# Altium schematic sheet Power.SchDoc
size A4; SheetNumber: 7; SheetTotal: 8
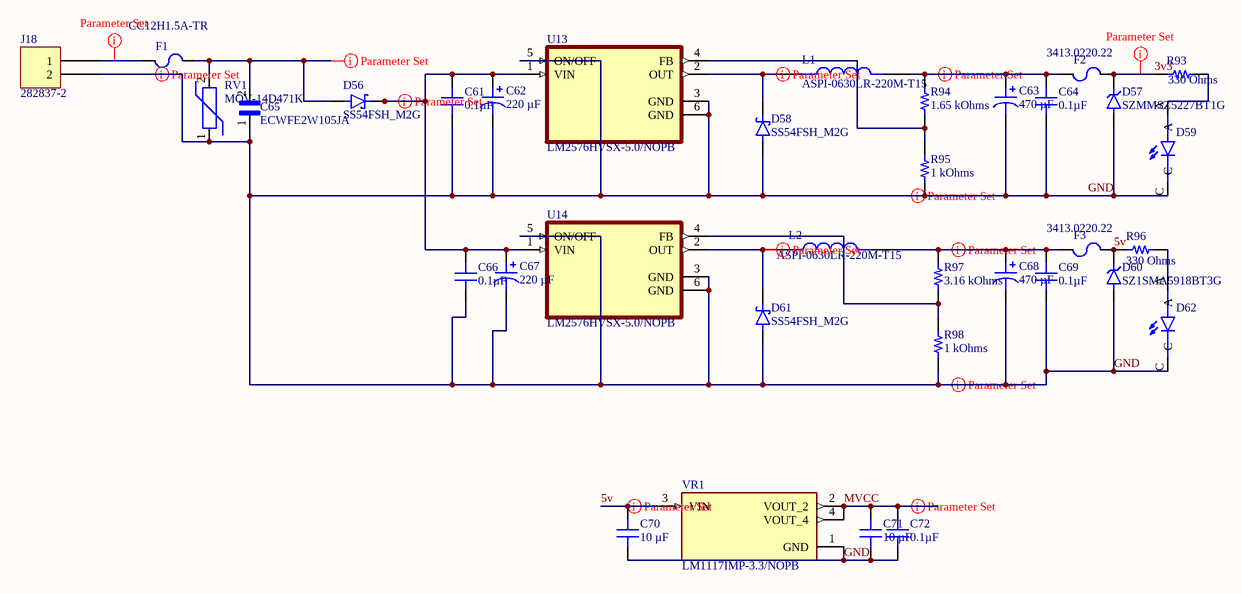
[diagram p0: Power.SchDoc]

## Parts
C61  Capacitance: 0.1µF  [CAP 0805_2012]  (hidden comment: 1µF)
C62  220 µF  [CAP ALSMD ELEC 8.3MM H11MM]
C63  470 µF  [CAP ALSMD 8.3MM H10.5MM]
C64  Capacitance: 0.1µF  [CAP 0805_2012]  (hidden comment: 1µF)
C65  ECWFE2W105JA  [CAPRR1500W80L1750T700H1250]
C66  Capacitance: 0.1µF  [CAP 0805_2012]  (hidden comment: 1µF)
C67  220 µF  [CAP ALSMD ELEC 8.3MM H11MM]
C68  470 µF  [CAP ALSMD 8.3MM H10.5MM]
C69  Capacitance: 0.1µF  [CAP 0805_2012]  (hidden comment: 1µF)
C70  10 µF  [MURATA CAP GRM31C 1206_3216]
C71  10 µF  [MURATA CAP GRM31C 1206_3216]
C72  Capacitance: 0.1µF  [CAP 0805_2012]  (hidden comment: 1µF)
D56  SS54FSH_M2G  [SODFL4725X110N]
D57  SZMMSZ5227BT1G  [DIO_SZMMSZ5227BT1G]
D58  SS54FSH_M2G  [SODFL4725X110N]
D59  597-3305-607F  [LEDC2012X70N]  (value not drawn)
D60  SZ1SMA5918BT3G  [DIOM5226X220N]
D61  SS54FSH_M2G  [SODFL4725X110N]
D62  597-3305-607F  [LEDC2012X70N]  (value not drawn)
F1  CC12H1.5A-TR  [FUSE 1206_3216 0.6MM]
F2  3413.0220.22  [FUSE 1206_3216 0.6MM]
F3  3413.0220.22  [FUSE 1206_3216 0.6MM]
J18  282837-2  [TE 282837-2]
L1  ASPI-0630LR-220M-T15  [IND_ASPI-0630LR-220M-T15]
L2  ASPI-0630LR-220M-T15  [IND_ASPI-0630LR-220M-T15]
R93  330 Ohms  [RES 0805_2012]
R94  1.65 kOhms  [RES 0805_2012]
R95  1 kOhms  [RES 0805_2012]
R96  330 Ohms  [RES 0805_2012]
R97  3.16 kOhms  [RES 0805_2012]
R98  1 kOhms  [RES 0805_2012]
RV1  MOV-14D471K  [MOV14D471K]
U13  LM2576HVSX-5.0/NOPB  [VREG_TPS79625KTTR]
U14  LM2576HVSX-5.0/NOPB  [VREG_TPS79625KTTR]
VR1  LM1117IMP-3.3/NOPB  [VREG_LM1117IMP-3.3/NOPB]

## Nets
3v3: D57.1(K) F2.2 R93.1
5v: C70.2 D60.C F3.2 R96.1 VR1.3(VIN)
GND: C61.1 C62.2 C63.2 C64.1 C65.1 C66.1 C67.2 C68.2 C69.1 C70.1 C71.1 C72.1 D57.2(A) D58.A D59.C D60.A D61.A D62.C J18.2 R95.2 R98.2 RV1.1 U13.3(GND) U13.5(ON/OFF) U13.6(GND) U14.3(GND) U14.5(ON/OFF) U14.6(GND) VR1.1(GND)
MVCC: C71.2 C72.2 VR1.2(VOUT_2) VR1.4(VOUT_4)
NetC61_2: C61.2 C62.1 C66.2 C67.1 D56.C(K) U13.1(VIN) U14.1(VIN)
NetC63_1: C63.1 C64.2 F2.1 L1.2 R94.1
NetC65_2: C65.2 D56.A F1.2 RV1.2
NetC68_1: C68.1 C69.2 F3.1 L2.2 R97.2
NetD58_C: D58.C(K) L1.1 U13.2(OUT)
NetD59_A: D59.A R93.2
NetD61_C: D61.C(K) L2.1 U14.2(OUT)
NetD62_A: D62.A R96.2
NetF1_1: F1.1 J18.1
NetR94_2: R94.2 R95.1 U13.4(FB)
NetR97_1: R97.1 R98.1 U14.4(FB)

## Layout directives
net class High_current: GND, NetC61_2, NetC63_1, NetC65_2, NetC68_1, NetD58_C, NetD61_C, NetF1_1
net class power: 3v3, 5v, GND, MVCC

## Library data of the parts
C61 C64 C66 C69 C72 = 0805ZC105KAT4A: CAP CER 1UF 10V X7R 0805; manufacturer: AVX Corporation; Tolerance: ±10%; Part Number: 0805ZC105KAT4A; Applications: General Purpose; componentlink1description: Datasheet; componentlink1url: http://datasheets.avx.com/X7RDielectric.pdf; componentlink2description: DigiKey Link; componentlink2url: http://digikey.com/product-detail/en/avx-corporation/0805ZC105KAT4A/478-7604-1-ND/7536237; Device Package: 0805 (2012 Metric); lastupdated: 02-09-2020 1.04.40 AM; Lifecycle Status: Active; Minimum Order: 1; Mounting Type: Surface Mount, MLCC; Operating Temperature: -55°C ~ 125°C; Package / Case: 0805 (2012 Metric); packaging: TapeAndReel; partid: 3500; Part Status: Active; price: 0.17; series: -; Size / Dimension: 0.079" L x 0.049" W (2.00mm x 1.25mm); Supplier 1: DigiKey; Supplier Part Number 1: 478-7604-1-ND; Temperature Coefficient: X7R; Thickness (Max): 0.037" (0.94mm); value: 1µF; Voltage - Rated: 10V
C62 C67 = UCH1V221MCS1GS: CAP ALUM 220UF 20% 35V SMD; manufacturer: Nichicon; ESR (Equivalent Series Resistance): 200mOhm @ 100kHz; Lifetime @ Temp.: 2000 Hrs @ 125°C; Polarization: Polar; Ripple Current @ High Frequency: 270 mA @ 100 kHz; Ripple Current @ Low Frequency: 135 mA @ 120 Hz; Surface Mount Land Size: 0.327" L x 0.327" W (8.30mm x 8.30mm); Part Number: UCH1V221MCS1GS; Applications: Automotive; Capacitance: 220 µF; componentlink1description: Datasheet; componentlink1url: https://www.nichicon.co.jp/english/series_items/catalog_pdf/e-uch.pdf; componentlink2description: DigiKey Link; componentlink2url: https://www.digikey.com/en/products/detail/nichicon/UCH1V221MCS1GS/13402772; Height - Seated (Max): 0.433" (11.00mm); lastupdated: 03-06-2024 8.26.59 PM; Lifecycle Status: Active; Minimum Order: 1; Mounting Type: Surface Mount; Operating Temperature: -40°C ~ 125°C; packaging: TapeAndReel; partid: 28619; price: 0.47; Ratings: AEC-Q200; series: UCH; Size / Dimension: 0.315" Dia (8.00mm); Supplier 1: DigiKey; Supplier Part Number 1: UCH1V221MCS1CT-ND; Tolerance: ±20%; value: 220 µF; Voltage - Rated: 35 V
C63 C68 = EMZL100ARA471MHA0G: CAP ALUM 470UF 20% 10V SMD; manufacturer: Chemi-Con; ESR (Equivalent Series Resistance): 160mOhm @ 100kHz; Lifetime @ Temp.: 5000 Hrs @ 105°C; Polarization: Polar; Ripple Current @ High Frequency: 600 mA @ 100 kHz; Ripple Current @ Low Frequency: 300 mA @ 120 Hz; Surface Mount Land Size: 0.327" L x 0.327" W (8.30mm x 8.30mm); Part Number: EMZL100ARA471MHA0G; Applications: Automotive; Capacitance: 470 µF; componentlink1description: Datasheet; componentlink1url: https://www.chemi-con.co.jp/products/relatedfiles/capacitor/catalog/MZLRA-e.PDF; componentlink2description: DigiKey Link; componentlink2url: https://www.digikey.com/en/products/detail/chemi-con/EMZL100ARA471MHA0G/17728433; Height - Seated (Max): 0.413" (10.50mm); lastupdated: 03-06-2024 8.15.40 PM; Lifecycle Status: Active; Minimum Order: 1; Mounting Type: Surface Mount; Operating Temperature: -55°C ~ 105°C; packaging: TapeAndReel; partid: 28535; price: 0.15; Ratings: AEC-Q200; series: Alchip™- MZL; Size / Dimension: 0.315" Dia (8.00mm); Supplier 1: DigiKey; Supplier Part Number 1: 565-EMZL100ARA471MHA0GCT-ND; Tolerance: ±20%; value: 470 µF; Voltage - Rated: 10 V
C70 C71 = GRM31CR71E106KA12K: CAP CER 10UF 25V X7R 1206; manufacturer: Murata Electronics; Tolerance: ±10%; Part Number: GRM31CR71E106KA12K; Capacitance: 10 µF; Applications: General Purpose; componentlink1description: Datasheet; componentlink1url: https://search.murata.co.jp/Ceramy/image/img/A01X/G101/ENG/GRM31CR71E106KA12-01.pdf; componentlink2description: DigiKey Link; componentlink2url: https://www.digikey.com/en/products/detail/murata-electronics/GRM31CR71E106KA12K/4905618; Device Package: 1206 (3216 Metric); lastupdated: 29-03-2026 9.05.15 PM; Lifecycle Status: Active; Minimum Order: 1; Mounting Type: Surface Mount, MLCC; Operating Temperature: -55°C ~ 125°C; Package / Case: 1206 (3216 Metric); packaging: TapeAndReel; partid: 19493; Part Status: Active; price: 0.07; series: GRM; Size / Dimension: 0.126" L x 0.063" W (3.20mm x 1.60mm); Supplier 1: DigiKey; Supplier Part Number 1: 490-14678-1-ND; Temperature Coefficient: X7R; Thickness (Max): 0.071" (1.80mm); value: 10 µF; Voltage - Rated: 25V
D56 D58 D61 = SS54FSH_M2G: Schottky Diodes & Rectifiers 5A, 40V, Schottky Rectifier; MF: Taiwan Semiconductor; MP: SS54FSH M2G; SnapEDA_Link: https://www.snapeda.com/parts/SS54FSH%20M2G/taiwan/view-part/?ref=snap; Package: None; Value: *; Check_prices: https://www.snapeda.com/parts/SS54FSH%20M2G/taiwan/view-part/?ref=eda
D59 D62 = 597-3305-607F: LED Uni-Color Green 4-Pin Chip 0805 T/R; Availability: Unavailable; Value: *; Price: None; MP: 597-3305-607F; Package: None
D60 = SZ1SMA5918BT3G: Zener Diode 5.1 V 1.5 W Â±5% Surface Mount SMA; MF: ON Semiconductor; SnapEDA_Link: https://www.snapeda.com/parts/SZ1SMA5918BT3G/Onsemi/view-part/?ref=snap; Package: SMA-2 ON Semiconductor; Value: *; MP: SZ1SMA5918BT3G; Check_prices: https://www.snapeda.com/parts/SZ1SMA5918BT3G/Onsemi/view-part/?ref=eda
F1 = CC12H1.5A-TR: FUSE BOARD MOUNT 1.5A 63VDC 1206; Manufacturer: Eaton - Electronics Division; Approval Agency: cURus; Breaking Capacity @ Rated Voltage: 50A; Fuse Type: Board Mount (Cartridge Style Excluded); Melting I²t: 0.4; Response Time: Slow Blow; Voltage Rating - DC: 63V; Part Number: CC12H1.5A-TR; Approvals: cURus; ComponentLink1Description: Datasheet; ComponentLink1URL: http://www.cooperindustries.com/content/dam/public/bussmann/Electronics/Resources/product-datasheets/Bus_Elx_DS_4309_CC12H_Series.pdf; ComponentLink2Description: DigiKey Link; ComponentLink2URL: http://digikey.com/product-detail/en/eaton-electronics-division/CC12H1.5A-TR/283-2979-1-ND/2138910; Current Rating (Amps): 1.5A; Device Package: 1206 (3216 Metric); LastUpdated: 02-09-2020 1.30.41 AM; Lifecycle Status: Active; Minimum Order: 1; Mounting Type: Surface Mount; Operating Temperature: -55°C ~ 125°C; Package / Case: 1206 (3216 Metric); Packaging: TapeAndReel; Part Status: Active; Price: 0.39; Series: CC12H; Size / Dimension: 0.126" L x 0.063" W x 0.024" H (3.20mm x 1.60mm x 0.60mm); Supplier 1: DigiKey; Supplier Part Number 1: 283-2979-1-ND
F2 F3 = 3413.0220.22: FUSE BOARD MNT 2.5A 32VAC 63VDC; Manufacturer: Schurter Inc.; Approval Agency: cURus, VDE; Breaking Capacity @ Rated Voltage: 63A; Fuse Type: Board Mount (Cartridge Style Excluded); Melting I²t: 0.94; Response Time: Fast Blow; Voltage Rating - AC: 32V; Voltage Rating - DC: 63V; Part Number: 3413.0220.22; Approvals: cURus, VDE; ComponentLink1Description: Datasheet; ComponentLink1URL: https://us.schurter.com/pdf/english/typ_USI_1206.pdf; ComponentLink2Description: DigiKey Link; ComponentLink2URL: http://digikey.com/product-detail/en/schurter-inc/3413.0220.22/486-1148-1-ND/1522980; Current Rating (Amps): 2.5A; Device Package: 1206 (3216 Metric); LastUpdated: 02-09-2020 1.30.41 AM; Lifecycle Status: Active; Minimum Order: 1; Mounting Type: Surface Mount; Operating Temperature: -55°C ~ 90°C; Package / Case: 1206 (3216 Metric); Packaging: TapeAndReel; Part Status: Active; Price: 0.26; Series: USI 1206; Size / Dimension: 0.126" L x 0.063" W x 0.024" H (3.20mm x 1.60mm x 0.60mm); Supplier 1: DigiKey; Supplier Part Number 1: 486-1148-1-ND
J18 = 282837-2: TERM BLK 2P SIDE ENT 5.08MM PCB; Manufacturer: TE Connectivity AMP Connectors; Current: 13.5 A; Mating Orientation: Horizontal with Board; Number of Levels: 1; Pitch: 0.200" (5.08mm); Positions Per Level: 2; Voltage: 300 V; Wire Gauge: 16-28 AWG; Wire Termination: Screw - Rising Cage Clamp; Part Number: 282837-2; Color: Green; ComponentLink1Description: Datasheet; ComponentLink1URL: https://www.te.com/commerce/DocumentDelivery/DDEController?Action=srchrtrv&DocNm=282837&DocType=Customer+Drawing&DocLang=English; ComponentLink2Description: DigiKey Link; ComponentLink2URL: https://www.digikey.com/en/products/detail/te-connectivity-amp-connectors/282837-2/2187973; Features: Interlocking (Side); LastUpdated: 21-06-2022 3.00.23 PM; Lifecycle Status: Active; Minimum Order: 1; Mounting Type: Through Hole; Packaging: Tray; Part Status: Active; Price: 0.31; Series: Buchanan; Supplier 1: DigiKey; Supplier Part Number 1: A113320-ND
L1 L2 = ASPI-0630LR-220M-T15: MF: {'manufacturer': u'Abracon LLC'}; Price: None; Package: None; MP: ASPI-0630LR-220M-T15; Availability: Unavailable; Value: *
R93 R96 = ERJ-PB6B3300V: RES SMD 330 OHM 0.1% 1/4W 0805; Manufacturer: Panasonic Electronic Components; Power (Watts): 0.25W, 1/4W; Temperature Coefficient: ±50ppm/°C; Part Number: ERJ-PB6B3300V; Value: 330 Ohms; ComponentLink1Description: Datasheet; ComponentLink1URL: https://industrial.panasonic.com/cdbs/www-data/pdf/RDM0000/AOA0000C328.pdf; ComponentLink2Description: DigiKey Link; ComponentLink2URL: https://www.digikey.com/en/products/detail/panasonic-electronic-components/ERJ-PB6B3300V/6213320; Composition: Thick Film; Device Package: 0805 (2012 Metric); Features: Automotive AEC-Q200, Pulse Withstanding; Height - Seated (Max): 0.028" (0.70mm); LastUpdated: 08-02-2024 9.02.05 PM; Lifecycle Status: Active; Minimum Order: 1; Number of Terminations: 2; Operating Temperature: -55°C ~ 155°C; Package / Case: 0805 (2012 Metric); Packaging: TapeAndReel; PartId: 35583; Part Status: Active; Price: 0.04; Ratings: AEC-Q200; Resistance: 330 Ohms; Series: ERJ-PB6; Size / Dimension: 0.079" L x 0.049" W (2.00mm x 1.25mm); Supplier 1: DigiKey; Supplier Part Number 1: P20537CT-ND; Supplier Device Package: 0805; Tolerance: ±0.1%
R94 = KTR10EZPF1651: RES SMD 1.65K OHM 1% 1/8W 0805; Manufacturer: Rohm Semiconductor; Power (Watts): 0.125W, 1/8W; Temperature Coefficient: ±100ppm/°C; Part Number: KTR10EZPF1651; Value: 1.65 kOhms; ComponentLink1Description: Datasheet; ComponentLink1URL: https://www.rohm.com/datasheet/KTR03EZPF/ktr-e; ComponentLink2Description: DigiKey Link; ComponentLink2URL: https://www.digikey.com/en/products/detail/rohm-semiconductor/KTR10EZPF1651/4051813; Composition: Thick Film; Device Package: 0805 (2012 Metric); Features: Automotive AEC-Q200, High Voltage; Height - Seated (Max): 0.026" (0.65mm); LastUpdated: 08-02-2024 9.02.33 PM; Lifecycle Status: Active; Minimum Order: 1; Number of Terminations: 2; Operating Temperature: -55°C ~ 155°C; Package / Case: 0805 (2012 Metric); Packaging: TapeAndReel; PartId: 29062; Part Status: Active; Price: 0.02; Ratings: AEC-Q200; Resistance: 1.65 kOhms; Series: KTR; Size / Dimension: 0.079" L x 0.049" W (2.00mm x 1.25mm); Supplier 1: DigiKey; Supplier Part Number 1: RHM1.65KAHCT-ND; Supplier Device Package: 0805; Tolerance: ±1%
R95 R98 = ESR10EZPF1001: RES SMD 1K OHM 1% 0.4W 0805; Manufacturer: Rohm Semiconductor; Power (Watts): 0.4W, 2/5W; Temperature Coefficient: ±100ppm/°C; Part Number: ESR10EZPF1001; Value: 1 kOhms; ComponentLink1Description: Datasheet; ComponentLink1URL: https://www.rohm.com/datasheet/ESR01MZPF/esr-e; ComponentLink2Description: DigiKey Link; ComponentLink2URL: https://www.digikey.com/en/products/detail/rohm-semiconductor/ESR10EZPF1001/1983480; Composition: Thick Film; Device Package: 0805 (2012 Metric); Features: Automotive AEC-Q200, Pulse Withstanding; Height - Seated (Max): 0.026" (0.65mm); LastUpdated: 08-02-2024 9.02.37 PM; Lifecycle Status: Active; Minimum Order: 1; Number of Terminations: 2; Operating Temperature: -55°C ~ 155°C; Package / Case: 0805 (2012 Metric); Packaging: TapeAndReel; PartId: 28032; Part Status: Active; Price: 0.02; Ratings: AEC-Q200; Resistance: 1 kOhms; Series: ESR; Size / Dimension: 0.079" L x 0.049" W (2.00mm x 1.25mm); Supplier 1: DigiKey; Supplier Part Number 1: RHM1.00KAECT-ND; Supplier Device Package: 0805; Tolerance: ±1%
R97 = CRCW08053K16FKEA: RES SMD 3.16K OHM 1% 1/8W 0805; Manufacturer: Vishay Dale; Power (Watts): 0.125W, 1/8W; Temperature Coefficient: ±100ppm/°C; Part Number: CRCW08053K16FKEA; Value: 3.16 kOhms; ComponentLink1Description: Datasheet; ComponentLink1URL: http://www.vishay.com/docs/20035/dcrcwe3.pdf; ComponentLink2Description: DigiKey Link; ComponentLink2URL: https://www.digikey.com/en/products/detail/vishay-dale/CRCW08053K16FKEA/1175692; Composition: Thick Film; Device Package: 0805 (2012 Metric); Features: Automotive AEC-Q200; Height - Seated (Max): 0.020" (0.50mm); LastUpdated: 08-02-2024 9.02.17 PM; Lifecycle Status: Active; Minimum Order: 1; Number of Terminations: 2; Operating Temperature: -55°C ~ 155°C; Package / Case: 0805 (2012 Metric); Packaging: TapeAndReel; PartId: 32701; Part Status: Active; Price: 0.01; Ratings: AEC-Q200; Resistance: 3.16 kOhms; Series: CRCW; Size / Dimension: 0.079" L x 0.049" W (2.00mm x 1.25mm); Supplier 1: DigiKey; Supplier Part Number 1: 541-3.16KCCT-ND; Supplier Device Package: 0805; Tolerance: ±1%
RV1 = MOV-14D471K: 470 V 4.5 kA Varistor 1 Circuit Through Hole Disc 14mm; MF: Bourns; SnapEDA_Link: https://www.snapeda.com/parts/MOV-14D471K/Bourns/view-part/?ref=snap; Check_prices: https://www.snapeda.com/parts/MOV-14D471K/Bourns/view-part/?ref=eda; Value: *; Purchase-URL: https://pricing.snapeda.com/search/part/MOV-14D471K/?ref=eda; Availability: In Stock; MP: MOV-14D471K; Price: None; Package: Disc-14 Bourns
U13 U14 = LM2576HVSX-5.0/NOPB: SIMPLE SWITCHERÂ® 4V to 60V, 3A Low Component Count Step-Down Regulator; MF: Texas Instruments; SnapEDA_Link: https://www.snapeda.com/parts/LM2576HVSX-5.0/NOPB/Texas+Instruments/view-part/?ref=snap; Package: TO-263-5 Texas Instruments; Value: *; MP: LM2576HVSX-5.0/NOPB; Check_prices: https://www.snapeda.com/parts/LM2576HVSX-5.0/NOPB/Texas+Instruments/view-part/?ref=eda
VR1 = LM1117IMP-3.3/NOPB: 800-mA 15-V linear voltage regulator; MF: Texas Instruments; SnapEDA_Link: https://www.snapeda.com/parts/LM1117IMP-3.3/NOPB/Texas+Instruments/view-part/?ref=snap; Package: SOT-223-4 Texas Instruments; Value: *; MP: LM1117IMP-3.3/NOPB; Check_prices: https://www.snapeda.com/parts/LM1117IMP-3.3/NOPB/Texas+Instruments/view-part/?ref=eda
C65 = ECWFE2W105JA: Value: *; Price: None; Availability: Unavailable; Package: None; MP: ECWFE2W105JA
D57 = SZMMSZ5227BT1G: Package: None; Price: None; Value: *; MP: SZMMSZ5227BT1G; Availability: Unavailable